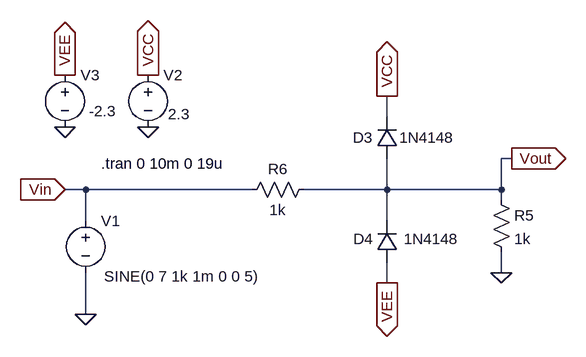
[diagram p0: schematic limiter1.asc]
limiter1.asc, the LTspice schematic file:
Version 4
SHEET 1 1284 680
WIRE 384 -48 384 -80
WIRE 576 16 560 16
WIRE -80 64 -112 64
WIRE 176 64 -80 64
WIRE 384 64 384 16
WIRE 384 64 256 64
WIRE 560 64 560 16
WIRE 560 64 384 64
WIRE 560 80 560 64
WIRE -80 112 -80 64
WIRE 384 112 384 64
WIRE 560 192 560 160
WIRE 384 208 384 176
WIRE -80 256 -80 192
FLAG -80 256 0
FLAG 560 192 0
FLAG -112 64 Vin
IOPIN -112 64 In
FLAG 576 16 Vout
IOPIN 576 16 Out
FLAG 16 -32 0
FLAG -112 -32 0
FLAG -112 -112 VEE
IOPIN -112 -112 Out
FLAG 16 -112 VCC
IOPIN 16 -112 Out
FLAG 384 208 VEE
IOPIN 384 208 Out
FLAG 384 -80 VCC
IOPIN 384 -80 Out
SYMBOL voltage -80 96 R0
WINDOW 123 0 0 Left 2
WINDOW 39 0 0 Left 2
WINDOW 3 268 102 Right 2
SYMATTR Value SINE(0 7 1k 1m 0 0 5)
SYMATTR InstName V1
SYMBOL diode 400 16 R180
WINDOW 0 38 32 Left 2
WINDOW 3 -88 32 Left 2
SYMATTR InstName D3
SYMATTR Value 1N4148
SYMBOL res 544 64 R0
SYMATTR InstName R5
SYMATTR Value 1k
SYMBOL res 272 48 R90
WINDOW 0 0 56 VBottom 2
WINDOW 3 32 56 VTop 2
SYMATTR InstName R6
SYMATTR Value 1k
SYMBOL diode 400 176 R180
WINDOW 0 37 36 Left 2
WINDOW 3 -95 36 Left 2
SYMATTR InstName D4
SYMATTR Value 1N4148
SYMBOL voltage 16 -128 R0
WINDOW 123 0 0 Left 2
WINDOW 39 0 0 Left 2
WINDOW 3 31 76 Left 2
SYMATTR Value 2.3
SYMATTR InstName V2
SYMBOL voltage -112 -128 R0
WINDOW 123 0 0 Left 2
WINDOW 39 0 0 Left 2
WINDOW 3 37 71 Left 2
SYMATTR Value -2.3
SYMATTR InstName V3
TEXT -56 24 Left 2 !.tran 0 10m 0 19u

The netlist it stands for:
* limiter1.asc
V1 Vin 0 SINE(0 7 1k 1m 0 0 5)
D3 Vout VCC 1N4148
R5 Vout 0 1k
R6 Vout Vin 1k
D4 VEE Vout 1N4148
V2 VCC 0 2.3
V3 VEE 0 -2.3
.model D D
.lib standard.dio
.tran 0 10m 0 19u
.backanno
.end